# EAGLE design MOSEFET_CONTROLLER_V8 (EAGLE 9.6.2)
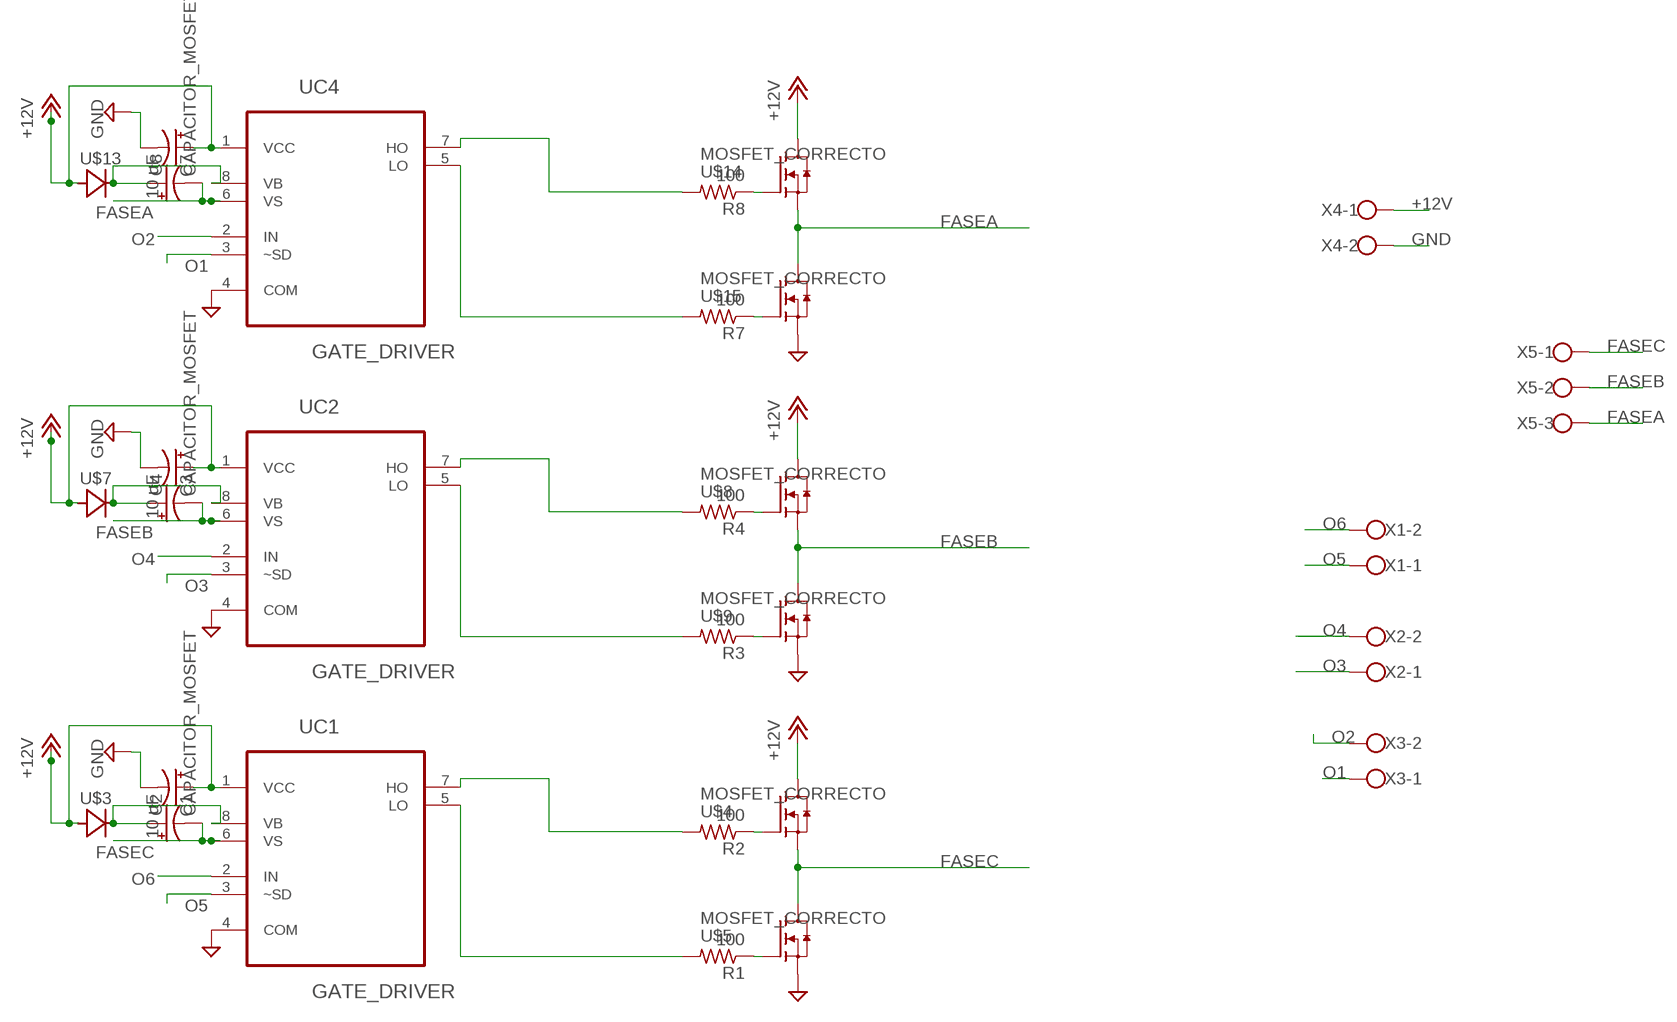
[diagram p0: schematic, sheet 1]

## Parts
C1  10 uF  CAP_SMD  [153CLV-0505]
C2  CAPACITOR_MOSFET  [E2,5-5]
C3  10 uF  CAP_SMD  [153CLV-0505]
C4  CAPACITOR_MOSFET  [E2,5-5]
C7  10 uF  CAP_SMD  [153CLV-0505]
C8  CAPACITOR_MOSFET  [E2,5-5]
R1  100  R-US_R1206  [R1206]
R2  100  R-US_R1206  [R1206]
R3  100  R-US_R1206  [R1206]
R4  100  R-US_R1206  [R1206]
R7  100  R-US_R1206  [R1206]
R8  100  R-US_R1206  [R1206]
U$3  DIODO_SMD  [DO214AC]
U$4  MOSFET_CORRECTO  [MOSFET_BUENO]
U$5  MOSFET_CORRECTO  [MOSFET_BUENO]
U$7  DIODO_SMD  [DO214AC]
U$8  MOSFET_CORRECTO  [MOSFET_BUENO]
U$9  MOSFET_CORRECTO  [MOSFET_BUENO]
U$13  DIODO_SMD  [DO214AC]
U$14  MOSFET_CORRECTO  [MOSFET_BUENO]
U$15  MOSFET_CORRECTO  [MOSFET_BUENO]
UC1  GATE_DRIVER  [GATE_DRIVER]
UC2  GATE_DRIVER  [GATE_DRIVER]
UC4  GATE_DRIVER  [GATE_DRIVER]
X1  W237-102  [W237-102]
X2  W237-102  [W237-102]
X3  W237-102  [W237-102]
X4  W237-102  [W237-102]
X5  W237-103  [W237-103]

## Nets
+12V: C1.+ C3.+ C7.+ U$3.A U$4.3(D) U$7.A U$8.3(D) U$13.A U$14.3(D) UC1.1(VCC) UC2.1(VCC) UC4.1(VCC) X4.1
FASEA: C8.- U$14.2(S) U$15.3(D) UC4.6(VS) X5.3
FASEB: C4.- U$8.2(S) U$9.3(D) UC2.6(VS) X5.2
FASEC: C2.- U$4.2(S) U$5.3(D) UC1.6(VS) X5.1
GND: C1.- C3.- C7.- U$5.2(S) U$9.2(S) U$15.2(S) UC1.4(COM) UC2.4(COM) UC4.4(COM) X4.2
N$1: R1.2 UC1.5(LO)
N$2: R2.2 UC1.7(HO)
N$3: R1.1 U$5.1(G)
N$4: R2.1 U$4.1(G)
N$5: C2.+ U$3.C UC1.8(VB)
N$6: R3.2 UC2.5(LO)
N$7: R4.2 UC2.7(HO)
N$8: R3.1 U$9.1(G)
N$9: R4.1 U$8.1(G)
N$10: C4.+ U$7.C UC2.8(VB)
N$16: R7.2 UC4.5(LO)
N$17: R8.2 UC4.7(HO)
N$18: R7.1 U$15.1(G)
N$19: R8.1 U$14.1(G)
N$20: C8.+ U$13.C UC4.8(VB)
O1: UC4.3(~SD) X3.1
O2: UC4.2(IN) X3.2
O3: UC2.3(~SD) X2.1
O4: UC2.2(IN) X2.2
O5: UC1.3(~SD) X1.1
O6: UC1.2(IN) X1.2

## Library data of the parts
C1 C3 C7 = LIBRERIA_IICO:CAP_SMD
C2 C4 C8 = MyLib:CAPACITOR_MOSFET
R1-R4 R7 R8 = rcl:R-US_: RESISTOR, American symbol; SPICEPREFIX: R
U$3 U$7 U$13 = DIODOS:DIODO_SMD
U$4 U$5 U$8 U$9 U$14 U$15 = MyLib:MOSFET_CORRECTO
UC1 UC2 UC4 = MyLib:GATE_DRIVER
X1-X4 = con-wago-500:W237-102: WAGO SCREW CLAMP; MPN: 237-102; OC_FARNELL: unknown; OC_NEWARK: 70K9898
X5 = con-wago-500:W237-103: WAGO SCREW CLAMP; MPN: 237-103; OC_FARNELL: unknown; OC_NEWARK: 18M7116

## Board
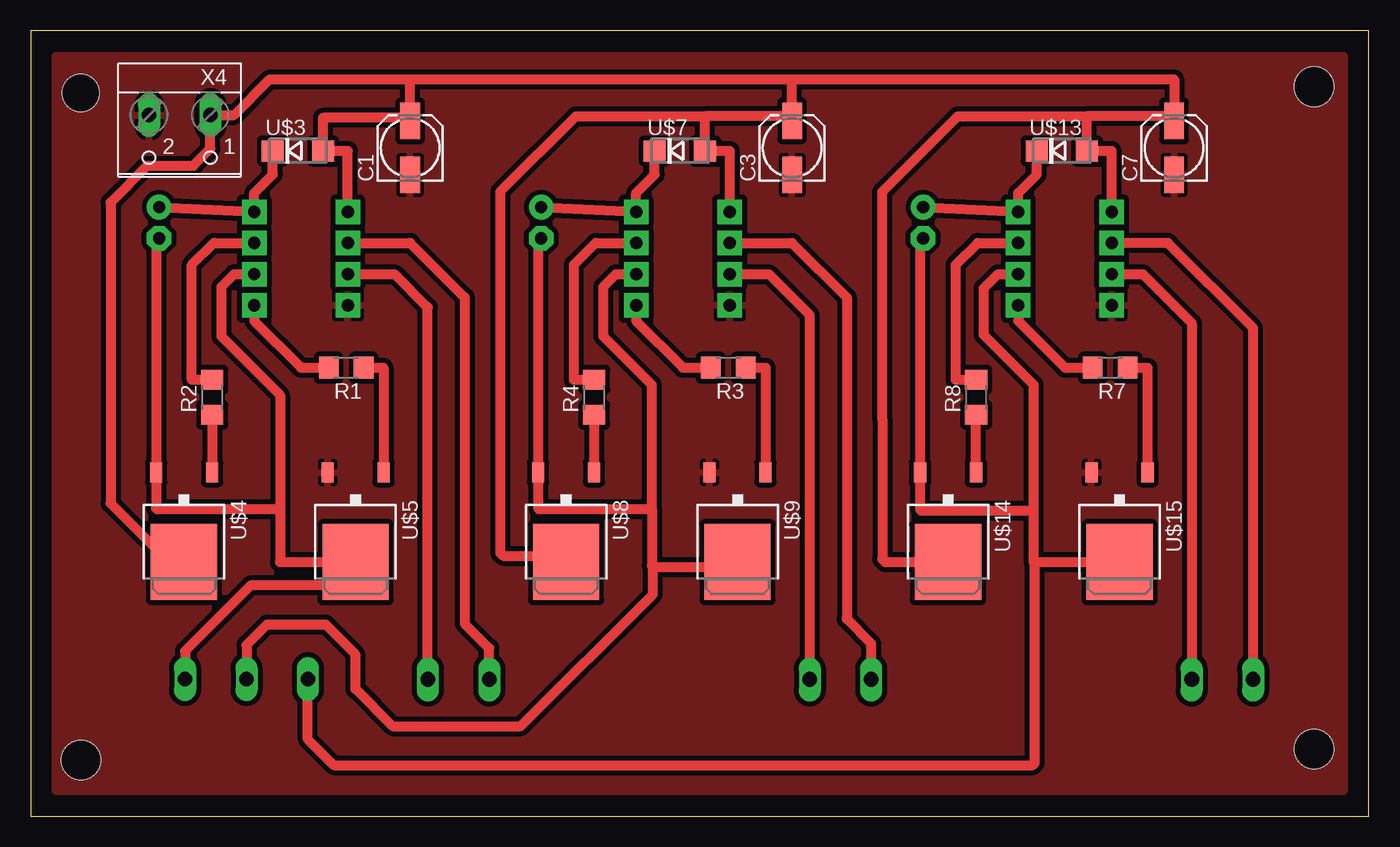
[diagram p1: board, top side]
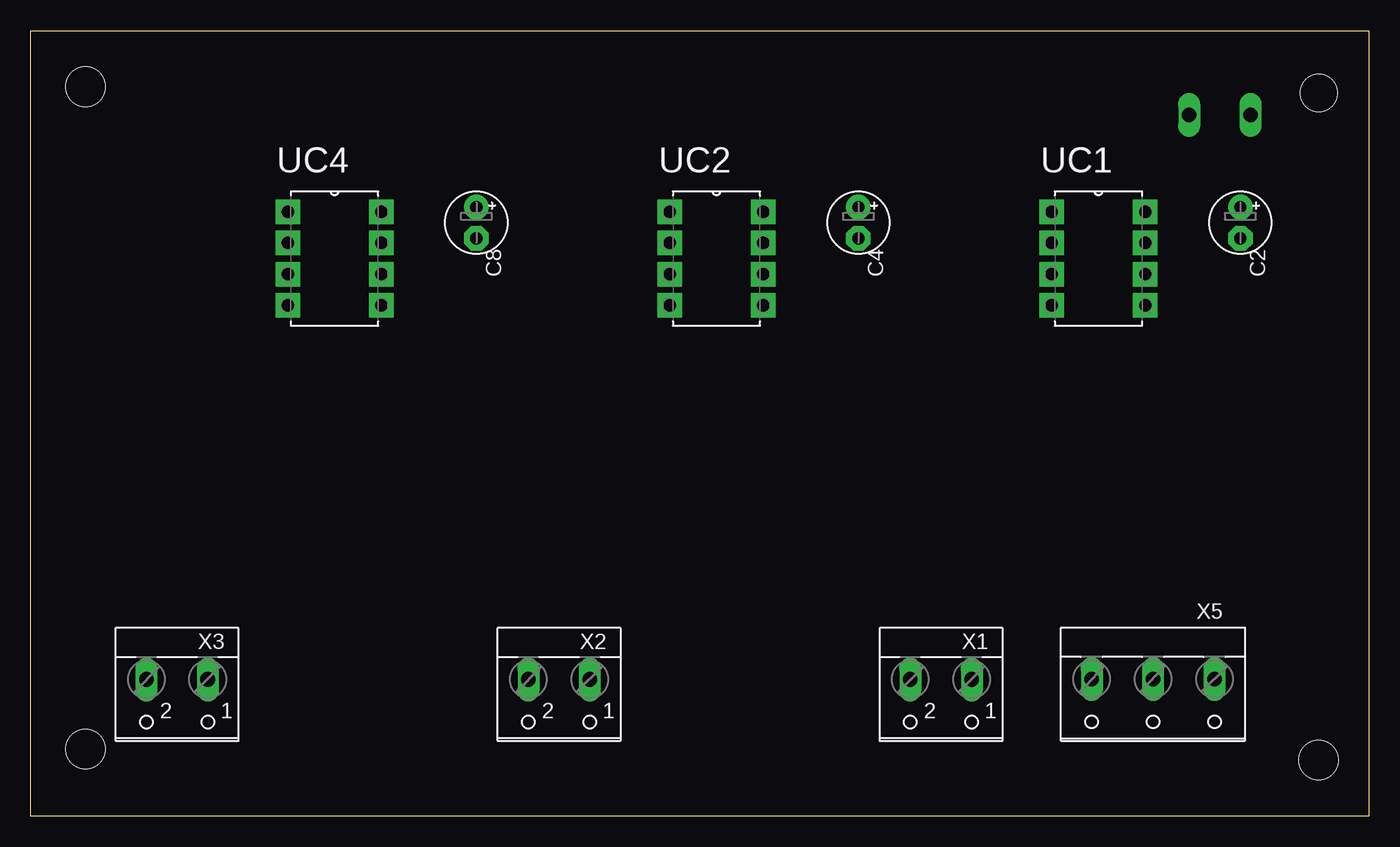
[diagram p2: board, bottom side, seen from below]

Size 109 x 64 mm. Coordinates in mm from the lower left corner, seen from the top.
Outline: 0,0 109,0 109,64 0,64 0,0
Copper layers (1*16): Top 0.035mm / dielectric 1.5mm / Bottom 0.035mm
Design rules "default *": minimum track width 6mil, minimum drill 0.35mm, track to track 0.4mm, track to pad 0.4mm, pad to pad 0.4mm, via to via 0.4mm, smd to smd 0.4mm, copper to edge 0mil, drill to drill 6mil, minimum pad ring 10mil, minimum via ring 8mil, stop-mask expansion 4mil, vias tented up to drill 0mil, thermal gap 12mil
Holes 3 mm at 4.09,58.93
Holes 3.2 mm at 4.09,4.57 104.52,59.44 104.52,5.46

### Footprints (pad centres in the part's own frame; a part is rotated, then mirrored left to right if it is on the bottom)
153CLV-0505 = smd 3 x 1.6: + 2.2,0; - -2.2,0
E2,5-5 = drill 1 pad 2: + -1.27,0 | drill 1 pad 2 octagon: - 1.27,0
R1206 = smd 1.6 x 1.803: 1 -1.422,0; 2 1.422,0
DO214AC = smd 1.8 x 1.7: A 2.05,0; C -2.05,0
MOSFET_BUENO = smd 1 x 1.6: 1 -2.28,-4.8; 2 2.28,-4.8 | smd 5.4 x 6.2: 3 0,2.5
GATE_DRIVER = drill 1 pad 2 square: 1 -7.62,7.62; 2 -7.62,5.08; 3 -7.62,2.54; 4 -7.62,0; 5 0,0; 6 0,2.54; 7 0,5.08; 8 0,7.62
W237-102 = drill 1.194 long: 1 -2.5,-1.27; 2 2.5,-1.27
W237-103 = drill 1.194 long: 1 -5,-1.29; 2 0,-1.29; 3 5,-1.29

### Placement (x,y rotation side)
C1  30.91,54.45 90 top
C2  10.46,48.36 270 bottom
C3  62.02,54.45 90 top
C4  41.58,48.36 270 bottom
C7  93.14,54.45 90 top
C8  72.69,48.36 270 bottom
R1  25.7,36.55 180 top
R2  14.78,34.13 90 top
R3  56.82,36.55 180 top
R4  45.9,34.13 90 top
R7  87.93,36.55 180 top
R8  77.01,34.13 90 top
U$3  21.77,54.2 0 top
U$4  12.49,23.21 180 top
U$5  26.46,23.21 180 top
U$7  52.88,54.2 0 top
U$8  43.61,23.21 180 top
U$9  57.58,23.21 180 top
U$13  84,54.2 0 top
U$14  74.72,23.21 180 top
U$15  88.69,23.21 180 top
UC1  18.21,41.62 0 bottom
UC2  49.33,41.62 0 bottom
UC4  80.44,41.62 0 bottom
X1  34.85,9.88 180 bottom
X2  65.96,9.88 180 bottom
X3  97.08,9.88 180 bottom
X4  12.13,55.86 180 top
X5  17.57,9.88 180 bottom

### Tracks (layer width: path | path; a pad name or v marks a point on that pad's centre or on a via)
+12V
  Top 0.813: UC1.1 25.83,54.2 U$3.A 23.82,56.91 30.66,56.91 C1.+ 30.91,60.04 | UC2.1 56.95,54.2 U$7.A 54.93,57.03 | 54.93,57.03 61.64,57.03 C3.+ 62.02,60.04 | 54.93,57.03 44.41,57.03 38.25,50.87 38.25,21.44 38.48,21.21 43.94,21.21 43.94,21.04 U$8.3 | UC4.1 88.06,54.2 U$13.A 86.05,57.03 | 86.05,57.03 92.76,57.03 C7.+ 93.14,60.04 62.02,60.04 | 86.05,57.03 75.53,57.03 69.36,50.87 69.36,33.53 69.36,32.38 69.36,20.98 69.34,20.95 69.6,20.7 74.8,20.7 75.18,21.08 75.1,21.08 U$14.3 | 30.91,60.04 19.48,60.04 16.57,57.13 X4.1 14.63,54.38 13.25,53 9.5,53 6.5,50 6.5,25.5 11.29,20.71 U$4.3 | 30.91,60.04 62.02,60.04
FASEA
  Top 0.813: UC4.6 78.79,44.16 77.65,43.02 77.65,39.21 81.72,35.14 81.72,25.15 | 81.72,20.71 81.72,25.15 | X5.3 22.57,6.27 24.69,4.16 81.63,4.16 81.79,4.32 81.79,20.64 81.72,20.71 | 81.72,20.71 88.39,20.71 U$15.3 | C8.- 72.44,46.83 U$14.2 72.44,24.96 72.52,24.89 81.46,24.89 81.72,25.15
FASEB
  Top 0.813: UC2.6 47.67,44.16 46.66,43.15 46.66,39.09 50.6,35.14 50.6,25.02 | X5.2 17.57,13.94 19.23,15.59 24.05,15.59 26.46,13.18 26.46,10.37 29.5,7.33 39.92,7.33 50.67,18.08 50.67,20.32 | C4.- 41.32,46.83 U$8.2 41.33,25.09 41.4,25.02 50.6,25.02 | 50.6,25.02 50.6,20.39 50.67,20.32 | 50.67,20.32 57.19,20.32 U$9.3
FASEC
  Top 0.813: UC1.6 16.56,44.16 15.54,43.15 15.54,39.09 20.31,34.31 20.31,25.02 | C2.- 10.21,46.83 U$4.2 10.21,25.09 10.29,25.02 20.31,25.02 | 20.31,25.02 20.31,20.71 U$5.3 24.55,18.8 17.91,18.8 12.57,13.46 X5.1
GND
  pour Top: 2,62 107,62 107,2 2,2
N$1
  Top 0.813: UC1.5 18.21,40.35 22.02,36.55 R1.2
N$2
  Top 0.813: UC1.7 14.91,46.7 13.13,44.93 13.13,35.55 R2.2
N$3
  Top 0.813: R1.1 28.75,36.55 U$5.1
N$4
  Top 0.813: U$4.1 14.78,28.02 R2.1
N$5
  Top 0.813: U$3.C 19.72,52.27 18.21,50.77 UC1.8 C2.+
N$6
  Top 0.813: UC2.5 49.33,40.35 53.13,36.55 R3.2
N$7
  Top 0.813: UC2.7 46.02,46.7 44.24,44.93 44.24,35.55 R4.2
N$8
  Top 0.813: R3.1 59.86,36.55 U$9.1
N$9
  Top 0.813: U$8.1 R4.1
N$10
  Top 0.813: U$7.C 50.83,52.27 49.33,50.77 UC2.8 C4.+
N$16
  Top 0.813: UC4.5 80.44,40.35 84.25,36.55 R7.2
N$17
  Top 0.813: UC4.7 77.14,46.7 75.36,44.93 75.36,35.55 R8.2
N$18
  Top 0.813: R7.1 90.97,36.55 U$15.1
N$19
  Top 0.813: U$14.1 R8.1
N$20
  Top 0.813: U$13.C 81.95,52.27 80.44,50.77 UC4.8 C8.+
O1
  Top 0.813: UC4.3 90.6,44.16 94.58,40.19 X3.1
O2
  Top 0.813: X3.2 99.58,39.76 92.63,46.7 UC4.2
O3
  Top 0.813: UC2.3 60.12,44.16 63.46,40.82 X2.1
O4
  Top 0.813: UC2.2 62.02,46.7 66.47,42.26 66.47,16.07 68.46,14.08 X2.2
O5
  Top 0.813: UC1.3 29.64,44.16 32.35,41.46 X1.1
O6
  Top 0.813: UC1.2 30.91,46.7 35.35,42.26 35.35,15.68 37.35,13.69 X1.2